# EAGLE design LED_board (EAGLE 7.5.0)
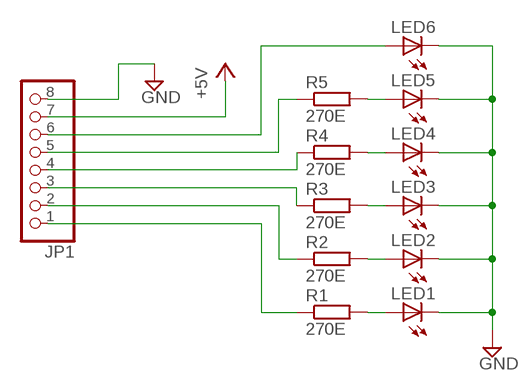
[diagram p0: schematic, sheet 1]

## Parts
JP1  PINHD-1X8  [1X08]
LED1  LED5MM  [LED5MM]
LED2  LED5MM  [LED5MM]
LED3  LED5MM  [LED5MM]
LED4  LED5MM  [LED5MM]
LED5  LED5MM  [LED5MM]
LED6  LED5MM  [LED5MM]
R1  270E  R-EU_R1206  [R1206]
R2  270E  R-EU_R1206  [R1206]
R3  270E  R-EU_R1206  [R1206]
R4  270E  R-EU_R1206  [R1206]
R5  270E  R-EU_R1206  [R1206]

## Nets
+5V: JP1.7
GND: JP1.8 LED1.K(C) LED2.K(C) LED3.K(C) LED4.K(C) LED5.K(C) LED6.K(C)
N$1: JP1.1 R1.1
N$2: JP1.2 R2.1
N$3: JP1.3 R3.1
N$4: JP1.4 R4.1
N$5: JP1.6 LED6.A
N$6: JP1.5 R5.1
N$7: LED5.A R5.2
N$8: LED4.A R4.2
N$9: LED3.A R3.2
N$10: LED2.A R2.2
N$11: LED1.A R1.2

## Library data of the parts
JP1 = pinhead:PINHD-1X8: PIN HEADER
LED1-LED6 = led:LED: LED OSRAM: - CHIPLED LG R971, LG N971, LY N971, LG Q971, LY Q971, LO R971, LY R971 LH N974, LH R974 LS Q976, LO Q976, LY Q976 LO Q996 - Hyper CHIPLED LW Q18S LB Q993, LB Q99A, LB R99A - SideLED LS A670, LO A670, LY A670, LG A670, LP A670 LB A673, LV A673, LT A673, LW A673 LH A674 LY A675 LS A676, LA A676, LO A676, LY A676, LW A676 LS A679, LY A679, LG A679 - Hyper Micro SIDELED® LS Y876, LA Y876, LO Y876, LY Y876 LT Y87S - SmartLED LW L88C, LW L88S LB L89C, LB L89S, LG L890 LS L89K, LO L89K, LY L89K LS L896, LA L896, LO L896, LY L896 - TOPLED LS T670, LO T670, LY T670, LG T670, LP T670 LSG T670, LSP T670, LSY T670, LOP T670, LYG T670 LG T671, LOG T671, LSG T671 LB T673, LV T673, LT T673, LW T673 LH T674 LS T676, LA T676, LO T676, LY T676, LB T676, LH T676, LSB T676, LW T676 LB T67C, LV T67C, LT T67C, LS T67K, LO T67K, LY T67K, LW E67C LS E67B, LA E67B, LO E67B, LY E67B, LB E67C, LV E67C, LT E67C LW T67C LS T679, LY T679, LG T679 LS T770, LO T770, LY T770, LG T770, LP T770 LB T773, LV T773, LT T773, LW T773 LH T774 LS E675, LA E675, LY E675, LS T675 LS T776, LA T776, LO T776, LY T776, LB T776 LHGB T686 LT T68C, LB T68C - Hyper Mini TOPLED® LB M676 - Mini TOPLED Santana® LG M470 LS M47K, LO M47K, LY M47K Source: http://www.osram.convergy.de LUXEON: - LUMILED® LXK2-PW12-R00, LXK2-PW12-S00, LXK2-PW14-U00, LXK2-PW14-V00 LXK2-PM12-R00, LXK2-PM12-S00, LXK2-PM14-U00 LXK2-PE12-Q00, LXK2-PE12-R00, LXK2-PE12-S00, LXK2-PE14-T00, LXK2-PE14-U00 LXK2-PB12-K00, LXK2-PB12-L00, LXK2-PB12-M00, LXK2-PB14-N00, LXK2-PB14-P00, LXK2-PB14-Q00 LXK2-PR12-L00, LXK2-PR12-M00, LXK2-PR14-Q00, LXK2-PR14-R00 LXK2-PD12-Q00, LXK2-PD12-R00, LXK2-PD12-S00 LXK2-PH12-R00, LXK2-PH12-S00 LXK2-PL12-P00, LXK2-PL12-Q00, LXK2-PL12-R00 Source: www.luxeon.com KINGBRIGHT: KA-3528ASYC Source: www.kingbright.com
R1-R5 = resistor:R-EU_: RESISTOR, European symbol

## Board
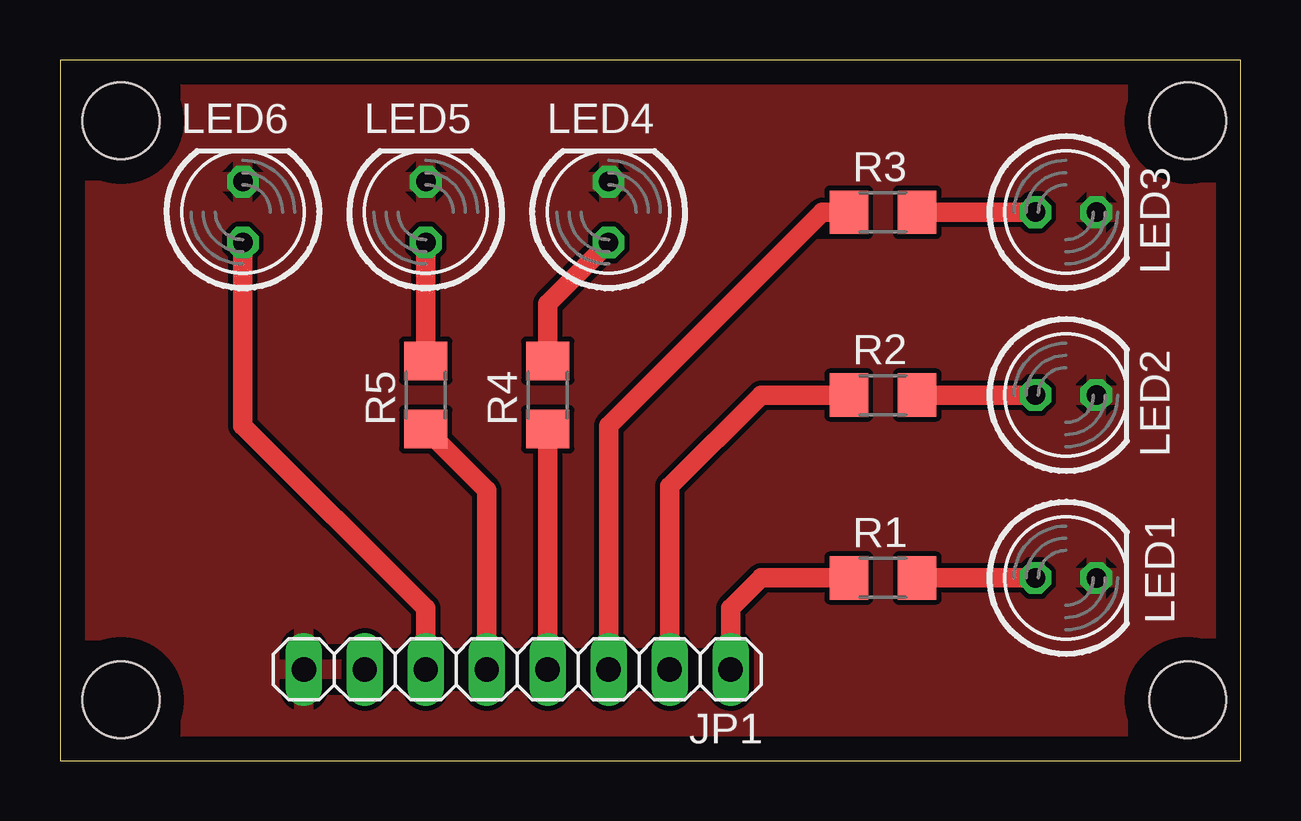
[diagram p1: board, top side]

Size 49.2 x 29.2 mm. Coordinates in mm from the lower left corner, seen from the top.
Outline: 0,0 49.2,0 49.2,29.2 0,29.2 0,0
Copper layers (1*16): Top 0.035mm / dielectric 1.5mm / Bottom 0.035mm
Design rules "default": minimum track width 10mil, minimum drill 24mil, track to track 8mil, track to pad 8mil, pad to pad 8mil, via to via 8mil, smd to smd 8mil, copper to edge 40mil, drill to drill 8mil, minimum pad ring 10mil, minimum via ring 8mil, stop-mask expansion 4mil, vias tented up to drill 0mil, thermal gap 10mil
Holes 3.2 mm at 46.99,26.67 46.99,2.54 2.54,2.54 2.54,26.67

### Footprints (pad centres in the part's own frame; a part is rotated, then mirrored left to right if it is on the bottom)
1X08 = drill 1.016 long: 1 -8.89,0; 2 -6.35,0; 3 -3.81,0; 4 -1.27,0; 5 1.27,0; 6 3.81,0; 7 6.35,0; 8 8.89,0
LED5MM = drill 0.813 octagon: A -1.27,0; K 1.27,0
R1206 = smd 1.6 x 1.803: 1 -1.422,0; 2 1.422,0

### Placement (x,y rotation side)
JP1  19.05,3.81 180 top
LED1  41.91,7.62 0 top
LED2  41.91,15.24 0 top
LED3  41.91,22.86 0 top
LED4  22.86,22.86 90 top
LED5  15.24,22.86 90 top
LED6  7.62,22.86 90 top
R1  34.29,7.62 0 top
R2  34.29,15.24 0 top
R3  34.29,22.86 0 top
R4  20.32,15.24 90 top
R5  15.24,15.24 90 top

### Tracks (layer width: path | path; a pad name or v marks a point on that pad's centre or on a via)
GND
  pour Top: 0,29.21 0,0 49.53,0 49.53,29.21
N$1
  Top 0.813: JP1.1 27.94,6.35 29.21,7.62 R1.1
N$2
  Top 0.813: JP1.2 25.4,11.43 29.21,15.24 R2.1
N$3
  Top 0.813: JP1.3 22.86,13.97 31.75,22.86 R3.1
N$4
  Top 0.813: JP1.4 R4.1
N$5
  Top 0.813: JP1.6 15.24,6.35 7.62,13.97 LED6.A
N$6
  Top 0.813: JP1.5 17.78,11.28 R5.1
N$7
  Top 0.813: R5.2 LED5.A
N$8
  Top 0.813: R4.2 20.32,19.05 LED4.A
N$9
  Top 0.813: R3.2 LED3.A
N$10
  Top 0.813: R2.2 LED2.A
N$11
  Top 0.813: R1.2 LED1.A